# Altium schematic sheet XDS100V2_EMULATOR.SchDoc: F2837x controlCARD
size 431 x 279 mm; Organization: Texas Instruments; Revision: 1.3
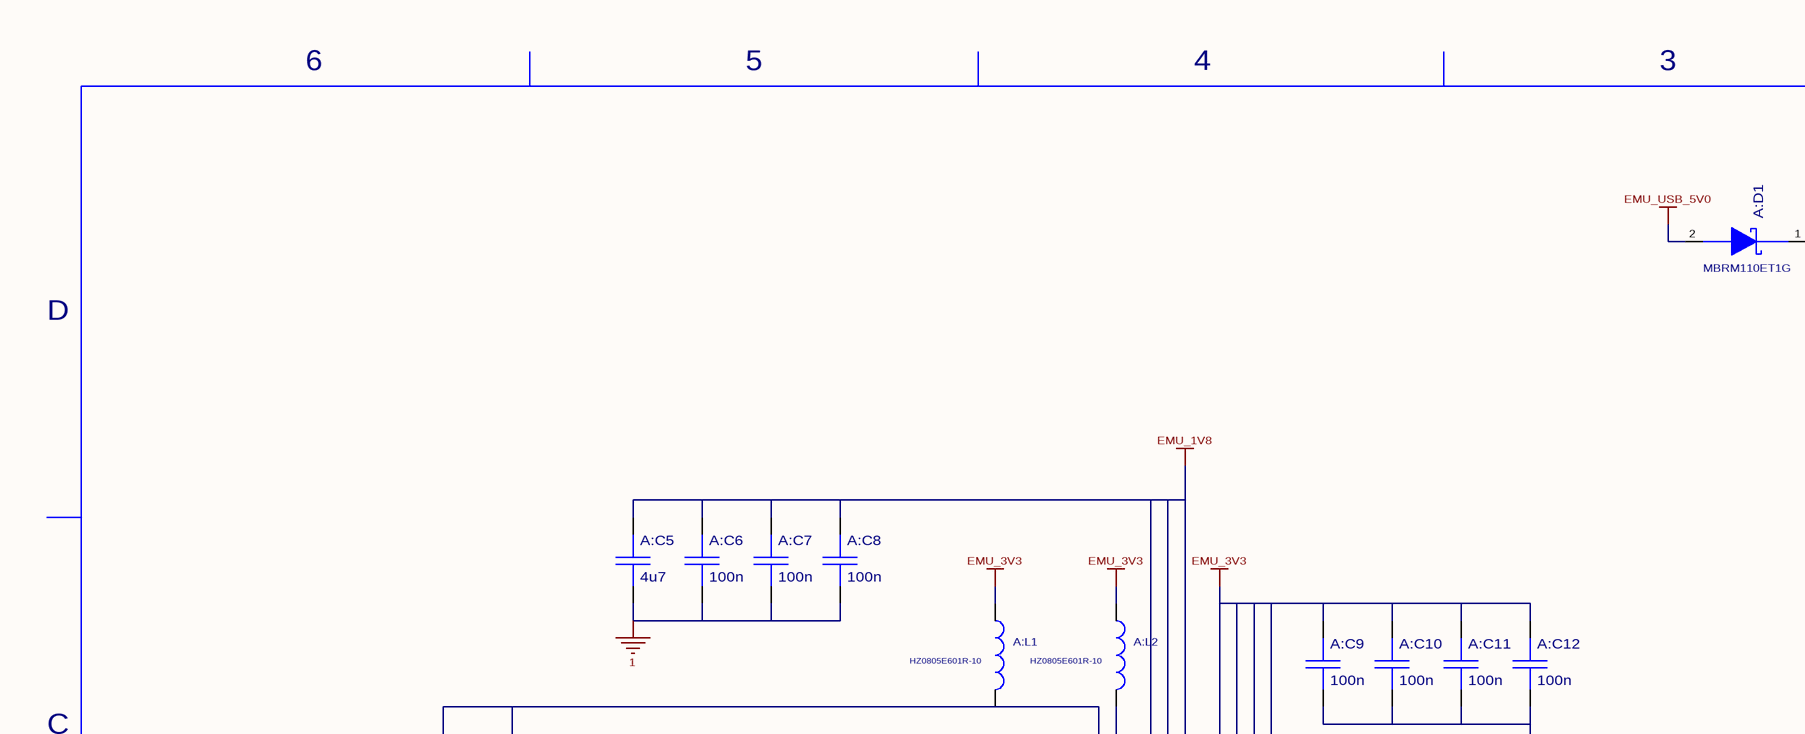
[diagram p0: XDS100V2_EMULATOR.SchDoc, top left]
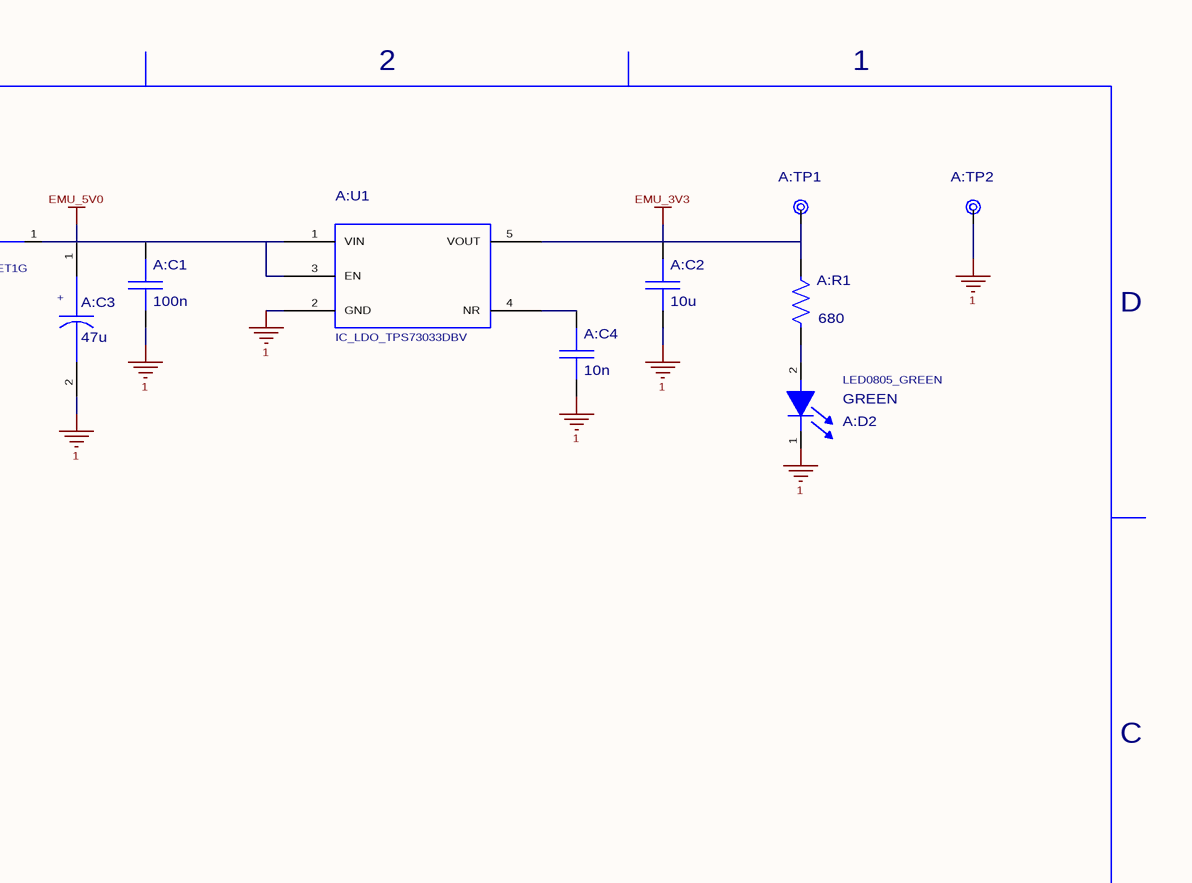
[diagram p1: XDS100V2_EMULATOR.SchDoc, top right]
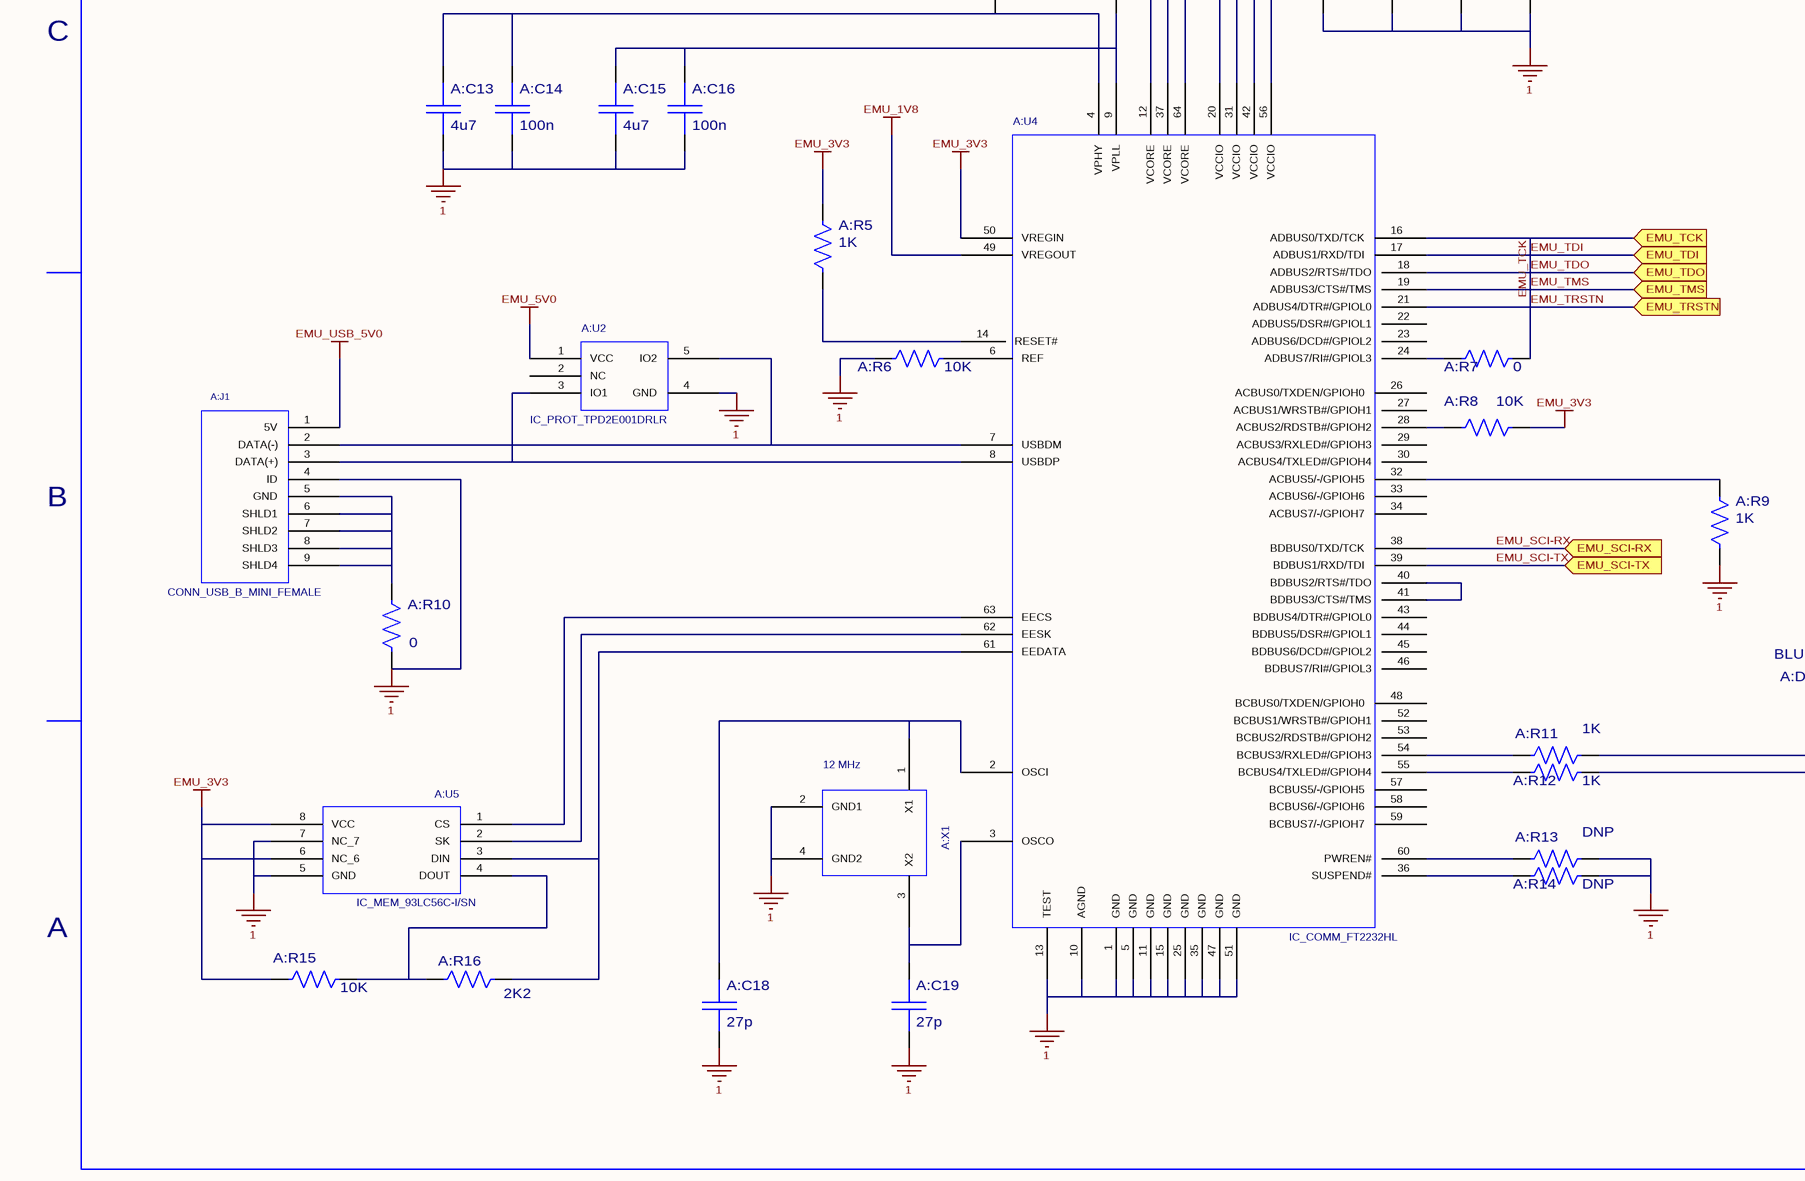
[diagram p2: XDS100V2_EMULATOR.SchDoc, bottom left]
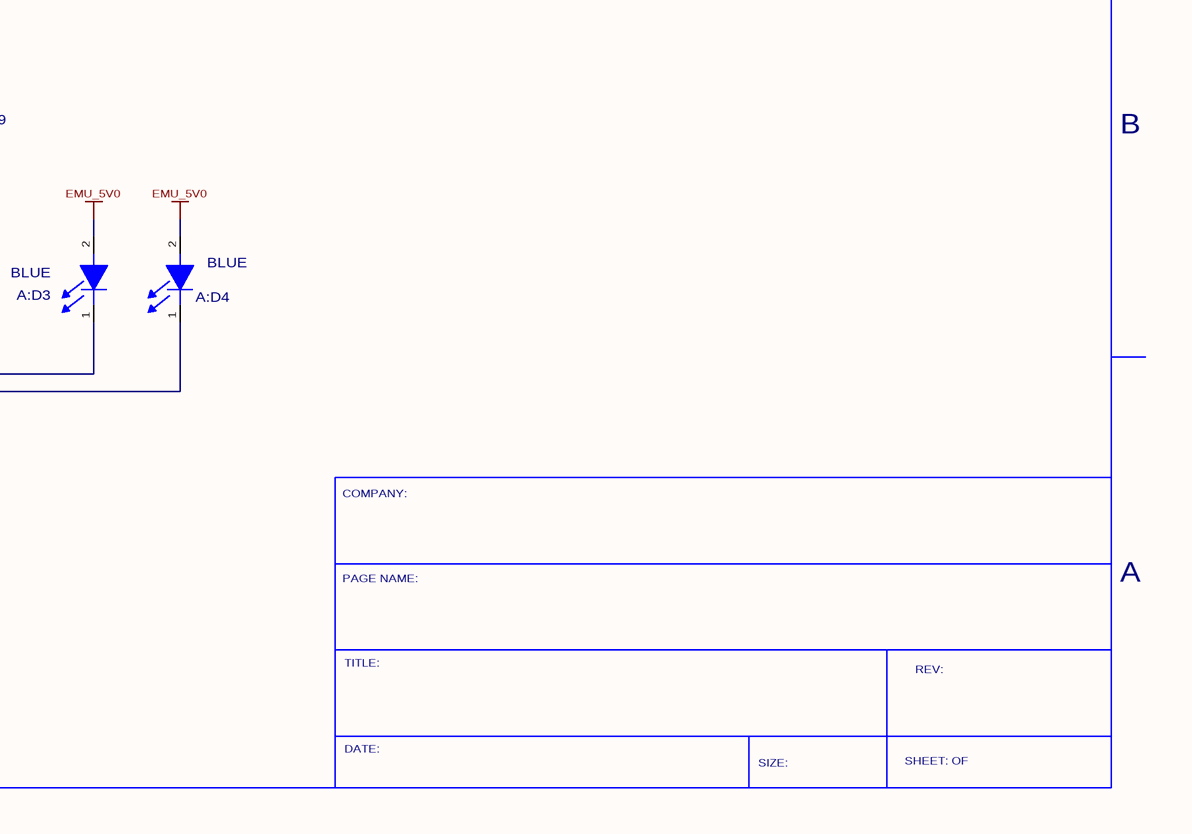
[diagram p3: XDS100V2_EMULATOR.SchDoc, bottom right]

## Parts
A:C1  value 100n  [C0402]  (hidden comment: C0402_16V_X7R)
A:C2  value 10u  [C0603]  (hidden comment: C0603_16V_X7R)
A:C3  value 47u  [C0805P]  (hidden comment: C0805_10V_TANT)
A:C4  value 10n  [C0402]  (hidden comment: C0402_16V_X7R)
A:C5  value 4u7  [C0603]  (hidden comment: C0603_16V_X7R)
A:C6  value 100n  [C0402]  (hidden comment: C0402_16V_X7R)
A:C7  value 100n  [C0402]  (hidden comment: C0402_16V_X7R)
A:C8  value 100n  [C0402]  (hidden comment: C0402_16V_X7R)
A:C9  value 100n  [C0402]  (hidden comment: C0402_16V_X7R)
A:C10  value 100n  [C0402]  (hidden comment: C0402_16V_X7R)
A:C11  value 100n  [C0402]  (hidden comment: C0402_16V_X7R)
A:C12  value 100n  [C0402]  (hidden comment: C0402_16V_X7R)
A:C13  value 4u7  [C0603]  (hidden comment: C0603_16V_X7R)
A:C14  value 100n  [C0402]  (hidden comment: C0402_16V_X7R)
A:C15  value 4u7  [C0603]  (hidden comment: C0603_16V_X7R)
A:C16  value 100n  [C0402]  (hidden comment: C0402_16V_X7R)
A:C18  value 27p  [C0402]  (hidden comment: C0402_50V_NP0)
A:C19  value 27p  [C0402]  (hidden comment: C0402_50V_NP0)
A:D1  Part Number: MBRM110ET1G  [DO-216AA]  (hidden comment: DIODE_SCHOTTKY_MBRM110ET1G)
A:D2  LED0805_GREEN  value GREEN  [LED0805]
A:D3  value BLUE  [LED0805]  (hidden comment: LED0805_BLUE)
A:D4  value BLUE  [LED0805]  (hidden comment: LED0805_BLUE)
A:J1  CONN_USB_B_MINI_FEMALE  [CONN_USB_B_MINI_FEMALE]
A:L1  Part Number: HZ0805E601R-10  [L0805]  (hidden comment: L0805_HZ0805E601R-10)
A:L2  Part Number: HZ0805E601R-10  [L0805]  (hidden comment: L0805_HZ0805E601R-10)
A:R1  value 680  [R0402]  (hidden comment: R0402_5%)
A:R5  value 1K  [R0402]  (hidden comment: R0402_5%)
A:R6  value 10K  [R0402]  (hidden comment: R0402_5%)
A:R7  value 0  [R0402]  (hidden comment: R0402_5%)
A:R8  value 10K  [R0402]  (hidden comment: R0402_5%)
A:R9  value 1K  [R0402]  (hidden comment: R0402_5%)
A:R10  value 0  [R0402]  (hidden comment: R0402_5%)
A:R11  value 1K  [R0402]  (hidden comment: R0402_5%)
A:R12  value 1K  [R0402]  (hidden comment: R0402_5%)
A:R13  value DNP  [R0402]  (hidden comment: R0402_5%)
A:R14  value DNP  [R0402]  (hidden comment: R0402_5%)
A:R15  value 10K  [R0402]  (hidden comment: R0402_5%)
A:R16  value 2K2  [R0402]  (hidden comment: R0402_5%)
A:TP1  VIA_20_40  [VIA_20_40]  (value not drawn)
A:TP2  VIA_20_40  [VIA_20_40]  (value not drawn)
A:U1  IC_LDO_TPS73033DBV  [SOT-23-5]
A:U2  IC_PROT_TPD2E001DRLR  [SOT-553-5]
A:U4  IC_COMM_FT2232HL  [QFN-64]
A:U5  IC_MEM_93LC56C-I/SN  [SOIC-8]
A:X1  value 12 MHz  [OSC_ECS-120-20-30B]  (hidden comment: OSC_ECS-120-20-30B-TR)

## Ports
EMU_SCI-RX, EMU_SCI-TX, EMU_TCK, EMU_TDI, EMU_TDO, EMU_TMS, EMU_TRSTN

## Nets
1: A:C1.1 A:C2.1 A:C3.2 A:C4.1 A:C5.1 A:C6.1 A:C7.1 A:C8.1 A:C9.1 A:C10.1 A:C11.1 A:C12.1 A:C13.1 A:C14.1 A:C15.1 A:C16.1 A:C18.1 A:C19.1 A:D2.1(C) A:J1.4(ID) A:R6.1 A:R9.2 A:R10.2 A:R13.2 A:R14.2 A:TP2.1 A:U1.2(GND) A:U2.4(GND) A:U4.1(GND) A:U4.5(GND) A:U4.10(AGND) A:U4.11(GND) A:U4.13(TEST) A:U4.15(GND) A:U4.25(GND) A:U4.35(GND) A:U4.47(GND) A:U4.51(GND) A:U5.5(GND) A:U5.7(NC_7) A:X1.2(GND1) A:X1.4(GND2)
EMU_1V8: A:C5.2 A:C6.2 A:C7.2 A:C8.2 A:U4.12(VCORE) A:U4.37(VCORE) A:U4.49(VREGOUT) A:U4.64(VCORE)
EMU_3V3: A:C2.2 A:C9.2 A:C10.2 A:C11.2 A:C12.2 A:L1.1 A:L2.1 A:R1.1 A:R5.1 A:R8.2 A:R15.1 A:TP1.1 A:U1.5(VOUT) A:U4.20(VCCIO) A:U4.31(VCCIO) A:U4.42(VCCIO) A:U4.50(VREGIN) A:U4.56(VCCIO) A:U5.6(NC_6) A:U5.8(VCC)
EMU_5V0: A:C1.2 A:C3.1 A:D1.1(C) A:D3.2(A) A:D4.2(A) A:U1.1(VIN) A:U1.3(EN) A:U2.1(VCC)
EMU_USB_5V0: A:D1.2(A) A:J1.1(5V)
EMU_SCI-RX: A:U4.38(BDBUS0/TXD/TCK) ; port EMU_SCI-RX
EMU_SCI-TX: A:U4.39(BDBUS1/RXD/TDI) ; port EMU_SCI-TX
EMU_TCK: A:R7.2 A:U4.16(ADBUS0/TXD/TCK) A:U4.17(ADBUS1/RXD/TDI) A:U4.18(ADBUS2/RTS#/TDO) A:U4.19(ADBUS3/CTS#/TMS) A:U4.21(ADBUS4/DTR#/GPIOL0) ; port EMU_TCK, port EMU_TDI, port EMU_TRSTN, port EMU_TMS, port EMU_TDO  [also labelled EMU_TDI, EMU_TDO, EMU_TMS, EMU_TRSTN]
NetA:C4_2: A:C4.2 A:U1.4(NR)
NetA:C13_2: A:C13.2 A:C14.2 A:L1.2 A:U4.4(VPHY)
NetA:C15_2: A:C15.2 A:C16.2 A:L2.2 A:U4.9(VPLL)
NetA:C18_2: A:C18.2 A:U4.2(OSCI) A:X1.1(X1)
NetA:C19_2: A:C19.2 A:U4.3(OSCO) A:X1.3(X2)
NetA:D2_2: A:D2.2(A) A:R1.2
NetA:D3_1: A:D3.1(C) A:R11.2
NetA:D4_1: A:D4.1(C) A:R12.2
NetA:J1_2: A:J1.2(DATA(-)) A:U2.5(IO2) A:U4.7(USBDM)
NetA:J1_3: A:J1.3(DATA(+)) A:U2.3(IO1) A:U4.8(USBDP)
NetA:J1_5: A:J1.5(GND) A:J1.6(SHLD1) A:J1.7(SHLD2) A:J1.8(SHLD3) A:J1.9(SHLD4) A:R10.1
NetA:R5_2: A:R5.2 A:U4.14(RESET#)
NetA:R6_2: A:R6.2 A:U4.6(REF)
NetA:R7_1: A:R7.1 A:U4.24(ADBUS7/RI#/GPIOL3)
NetA:R8_1: A:R8.1 A:U4.28(ACBUS2/RDSTB#/GPIOH2)
NetA:R9_1: A:R9.1 A:U4.32(ACBUS5/-/GPIOH5)
NetA:R11_1: A:R11.1 A:U4.54(BCBUS3/RXLED#/GPIOH3)
NetA:R12_1: A:R12.1 A:U4.55(BCBUS4/TXLED#/GPIOH4)
NetA:R13_1: A:R13.1 A:U4.60(PWREN#)
NetA:R14_1: A:R14.1 A:U4.36(SUSPEND#)
NetA:R15_2: A:R15.2 A:R16.1 A:U5.4(DOUT)
NetA:R16_2: A:R16.2 A:U4.61(EEDATA) A:U5.3(DIN)
NetA:U4_40: A:U4.40(BDBUS2/RTS#/TDO) A:U4.41(BDBUS3/CTS#/TMS)
NetA:U4_62: A:U4.62(EESK) A:U5.2(SK)
NetA:U4_63: A:U4.63(EECS) A:U5.1(CS)

Not connected (* = marked no-connect by the designer): A:U2 2(NC); A:U4 22(ADBUS5/DSR#/GPIOL1) 23(ADBUS6/DCD#/GPIOL2) 26(ACBUS0/TXDEN/GPIOH0) 27(ACBUS1/WRSTB#/GPIOH1) 29(ACBUS3/RXLED#/GPIOH3) 30(ACBUS4/TXLED#/GPIOH4) 33(ACBUS6/-/GPIOH6) 34(ACBUS7/-/GPIOH7) 43(BDBUS4/DTR#/GPIOL0) 44(BDBUS5/DSR#/GPIOL1) 45(BDBUS6/DCD#/GPIOL2) 46(BDBUS7/RI#/GPIOL3) 48(BCBUS0/TXDEN/GPIOH0) 52(BCBUS1/WRSTB#/GPIOH1) 53(BCBUS2/RDSTB#/GPIOH2) 57(BCBUS5/-/GPIOH5) 58(BCBUS6/-/GPIOH6) 59(BCBUS7/-/GPIOH7)

## Notes on the sheet
- 6
- 5
- 4
- 3
- 2
- 1
- D
- C
- B
- COMPANY:
- A
- PAGE NAME:
- TITLE:
- REV:
- DATE:
- SIZE:
- SHEET: OF
- (in symbol C0805_10V_TANT) +

## Library data of the parts
A:C1 A:C4 A:C6-A:C12 A:C14 A:C16 = C0402_16V_X7R: CAP CER 16V 10% X7R 0402; Decal: C0402; PCB DECAL: C0402
A:C2 = C0603_16V_X7R: CAP CER 6.3V 20% X5R 0603; Decal: C0603; PCB DECAL: C0603
A:C3 = C0805_10V_TANT: CAP TANT 20% 0805 6.3V; Part Number: TCTP0J476M8R; Decal: C0805P; Digikey: 511-1682-1-ND; PCB DECAL: C0805P
A:C5 A:C13 A:C15 = C0603_16V_X7R: CAP CER 6.3V 10% X5R 0603; Decal: C0603; PCB DECAL: C0603
A:C18 A:C19 = C0402_50V_NP0: CAP CER 50V NP0 0402; Decal: C0402; PCB DECAL: C0402
A:D1 = DIODE_SCHOTTKY_MBRM110ET1G: DIODE SCHOTTKY 10V 1A POWERMITE; Manufacturer: On Semiconductor; Decal: DO-216AA; Digikey: MBRM110ET1GOSCT-ND; PCB DECAL: DO-216AA
A:D2 = LED0805_GREEN: LED GREEN 0805 SMD, Diffused, 567nm; Decal: LED0805; PCB DECAL: LED0805
A:D3 A:D4 = LED0805_BLUE: LED BLUE 0805 SMD, Clear, 470nm; Decal: LED0805; PCB DECAL: LED0805
A:J1 = CONN_USB_B_MINI_FEMALE: CONN RECEPT MINI USB2.0 5POS; Part Number: UX60-MB-5ST; Decal: CONN_USB_B_MINI_FEMALE; Digikey: H2959CT-ND; PCB DECAL: CONN_USB_B_MINI_FEMALE
A:L1 A:L2 = L0805_HZ0805E601R-10: FERRITE 500MA 600 OHM 0805 SMD; Decal: L0805; Digikey: 240-2399-1-ND; PCB DECAL: L0805
A:R1 A:R5-A:R16 = R0402_5%: RES 1/16W 5% 0402 SMD; Decal: R0402; PCB DECAL: R0402
A:TP1 A:TP2 = VIA_20_40: Via, 20 ID, 40 OD (mil); Decal: VIA_20_40; Size: 20 ID, 40 OD (mil); PCB DECAL: VIA_20_40
A:U1 = IC_LDO_TPS73033DBV: IC LDO REG HI-PSRR 3.3V SOT23-5; Decal: SOT-23-5; Digikey: 296-17580-1-ND; Part Number: TPS73033DBV; PCB DECAL: SOT-23-5
A:U2 = IC_PROT_TPD2E001DRLR: IC ESD-PROT ARRAY 2CH SOT-5; Decal: SOT-553-5; Digikey: 296-21883-1-ND; Part Number: TPD2E001DRLR; PCB DECAL: SOT-553-5
A:U4 = IC_COMM_FT2232HL: IC USB HS DUAL UART/FIFO 64-QFN; Decal: QFN-64; Digikey: 768-1024-1-ND; Part Number: FT2232HL; PCB DECAL: QFN-64
A:U5 = IC_MEM_93LC56C-I/SN: IC EEPROM 2KBIT 3MHZ 8SOIC; Decal: SOIC-8; Digikey: 93LC56C-I/SN-ND; Part Number: 93LC56C-I/SN; PCB DECAL: SOIC-8
A:X1 = OSC_ECS-120-20-30B-TR: CRYSTAL 12.000 MHZ 20PF SMD; Decal: OSC_ECS-120-20-30B; Digikey: XC1118CT-ND; Part Number: ECS-120-20-30B-TR; PCB DECAL: OSC_ECS-120-20-30B